# EAGLE design Buttons (EAGLE 7.7.0)
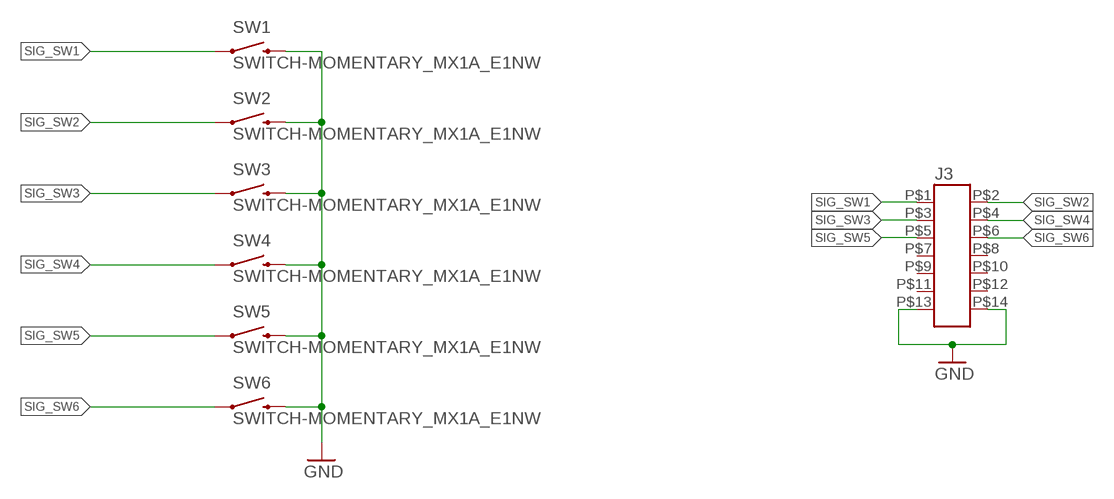
[diagram p0: schematic, sheet 1]

## Parts
J3  HEADER-2X7  [3M-3000SERIES-HEADER-RIGHTANGLE]
SW1  SWITCH-MOMENTARY_MX1A_E1NW  [CHERRY_MX1A_E1NW]
SW2  SWITCH-MOMENTARY_MX1A_E1NW  [CHERRY_MX1A_E1NW]
SW3  SWITCH-MOMENTARY_MX1A_E1NW  [CHERRY_MX1A_E1NW]
SW4  SWITCH-MOMENTARY_MX1A_E1NW  [CHERRY_MX1A_E1NW]
SW5  SWITCH-MOMENTARY_MX1A_E1NW  [CHERRY_MX1A_E1NW]
SW6  SWITCH-MOMENTARY_MX1A_E1NW  [CHERRY_MX1A_E1NW]

## Nets
GND: J3.P$13 J3.P$14 SW1.P$2 SW2.P$2 SW3.P$2 SW4.P$2 SW5.P$2 SW6.P$2
SIG_SW1: J3.P$1 SW1.P$1
SIG_SW2: J3.P$2 SW2.P$1
SIG_SW3: J3.P$3 SW3.P$1
SIG_SW4: J3.P$4 SW4.P$1
SIG_SW5: J3.P$5 SW5.P$1
SIG_SW6: J3.P$6 SW6.P$1
Unconnected: J3.P$7 J3.P$8 J3.P$9 J3.P$10 J3.P$11 J3.P$12

## Library data of the parts
J3 = Nigel:HEADER-2X7
SW1-SW6 = Nigel:SWITCH-MOMENTARY

## Board
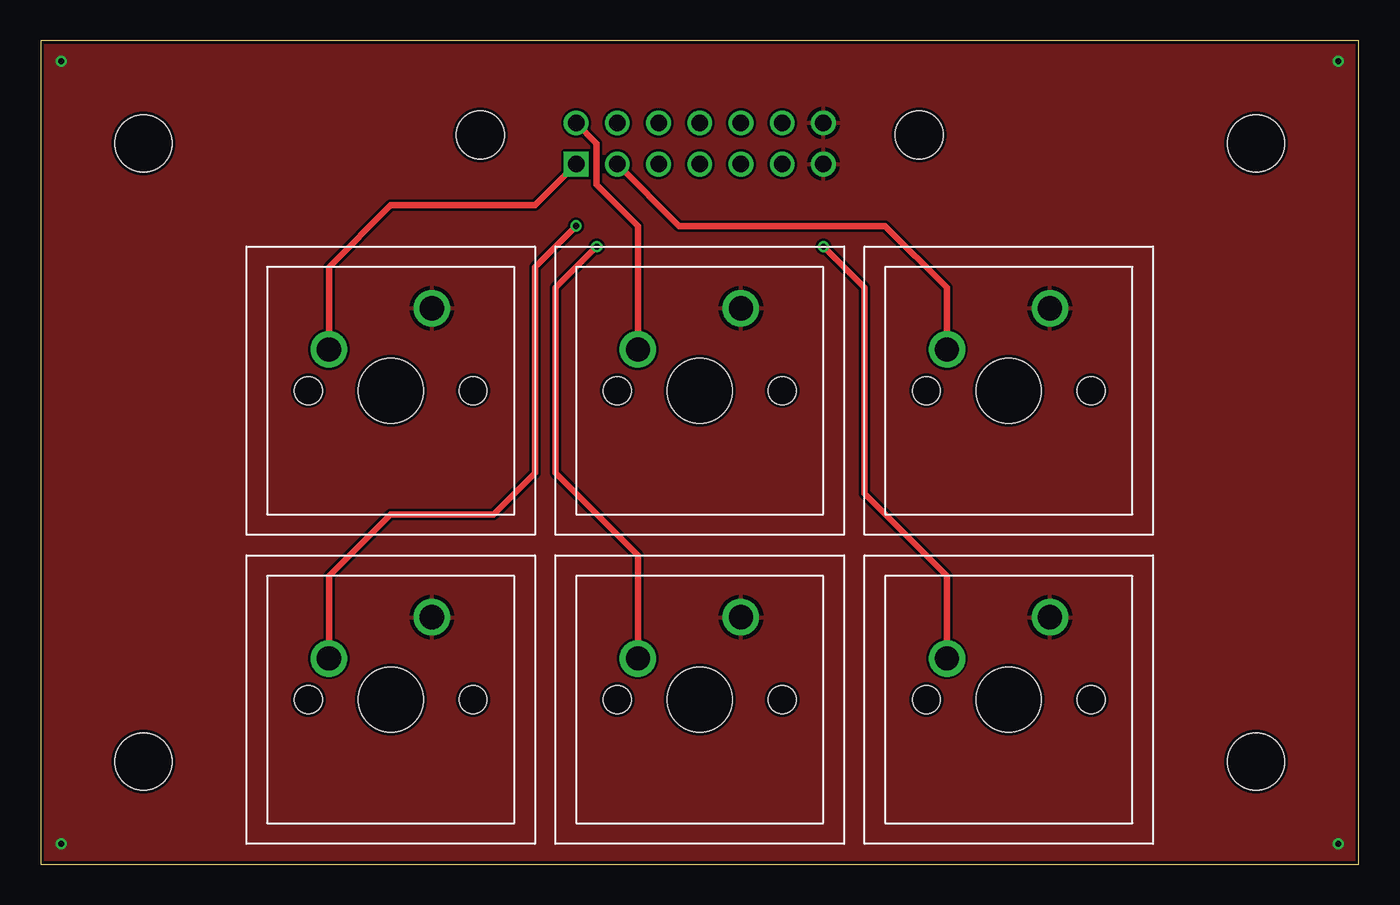
[diagram p1: board, top side]
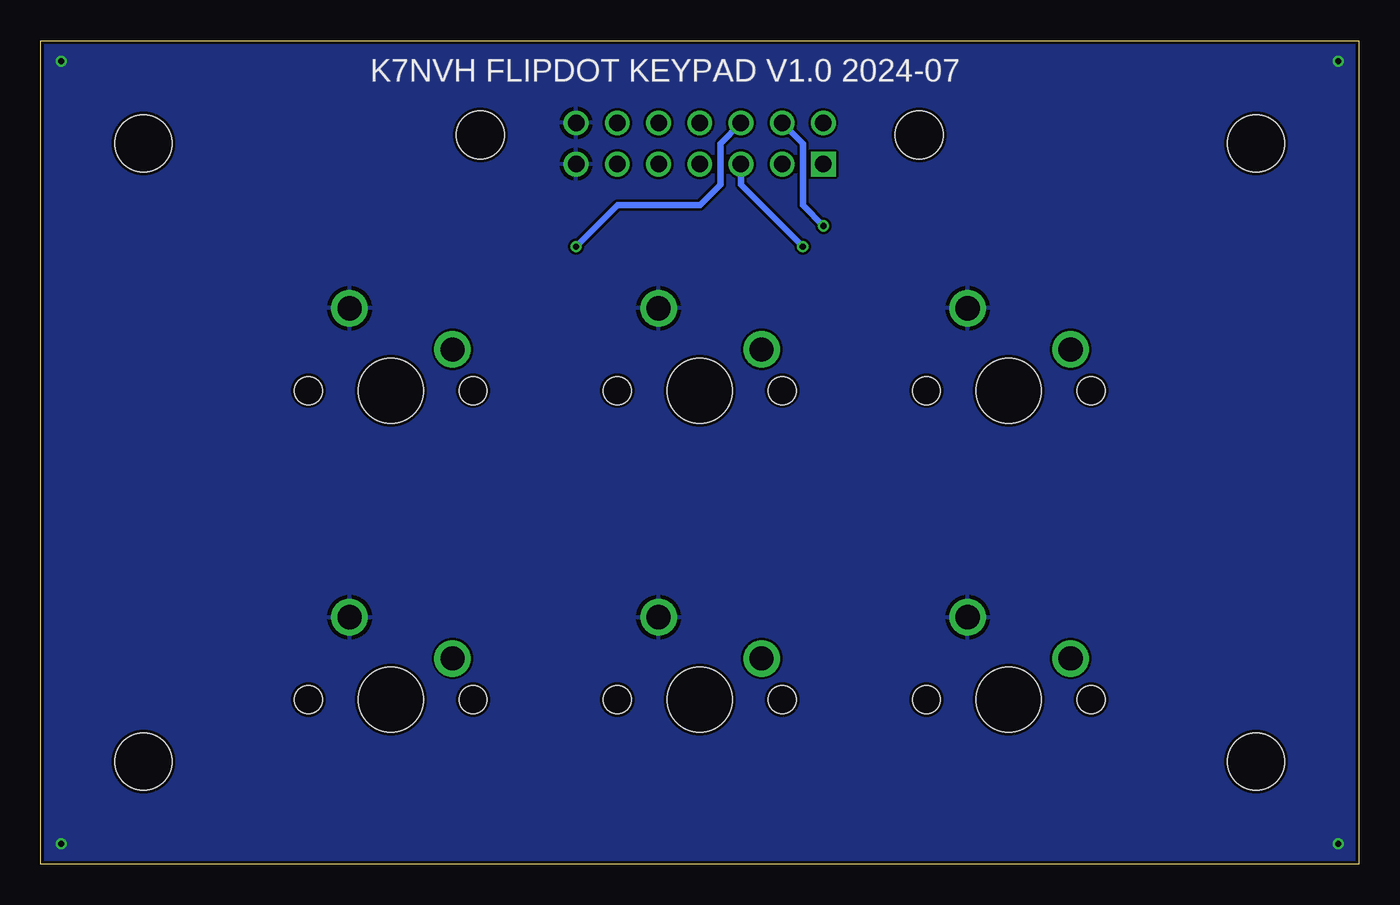
[diagram p2: board, bottom side, seen from below]

Size 81.28 x 50.8 mm. Coordinates in mm from the lower left corner, seen from the top.
Outline: 0,0 81.28,0 81.28,50.8 0,50.8 0,0
Copper layers (1*16): Top 0.0356mm / dielectric 1.5011mm / Bottom 0.0356mm
Design rules "JLCPCB *": minimum track width 5mil, minimum drill 6mil, track to track 6mil, track to pad 6mil, pad to pad 6mil, via to via 6mil, smd to smd 6mil, copper to edge 8mil, drill to drill 6mil, minimum pad ring 7mil, minimum via ring 6mil, stop-mask expansion 3mil, vias tented up to drill 12mil, thermal gap 10mil
Holes 3.51 mm at 6.35,6.35 74.93,6.35 6.35,44.45 74.93,44.45

### Footprints (pad centres in the part's own frame; a part is rotated, then mirrored left to right if it is on the bottom)
3M-3000SERIES-HEADER-RIGHTANGLE = drill 1.016 square: P$1 -7.62,-1.27 | drill 1.016: P$2 -7.62,1.27; P$3 -5.08,-1.27; P$4 -5.08,1.27; P$5 -2.54,-1.27; P$6 -2.54,1.27; P$7 0,-1.27; P$8 0,1.27; P$9 2.54,-1.27; P$10 2.54,1.27; P$11 5.08,-1.27; P$12 5.08,1.27; P$13 7.62,-1.27; P$14 7.62,1.27 | hole 2.946: -13.525,0.533; 13.525,0.533
CHERRY_MX1A_E1NW = drill 1.499: P$1 -3.81,2.54; P$2 2.54,5.08 | hole 3.988: 0,0 | hole 1.702: -5.08,0; 5.08,0

### Placement (x,y rotation side)
J3  40.64,44.45 0 top
SW1  21.59,29.21 0 top
SW2  40.64,29.21 0 top
SW3  59.69,29.21 0 top
SW4  21.59,10.16 0 top
SW5  40.64,10.16 0 top
SW6  59.69,10.16 0 top

### Tracks (layer width: path | path; a pad name or v marks a point on that pad's centre or on a via)
GND  (via drill 0.38)
  other vias: 1.27,49.53 80.01,49.53 80.01,1.27 1.27,1.27
  pour Top: 0,50.8 81.28,50.8 81.28,0 0,0
  pour Bottom: 0,50.8 81.28,50.8 81.28,0 0,0
SIG_SW1
  Top 0.406: SW1.P$1 17.78,36.83 21.59,40.64 30.48,40.64 J3.P$1
SIG_SW2
  Top 0.406: SW2.P$1 36.83,39.37 34.29,41.91 34.29,44.45 J3.P$2
SIG_SW3
  Top 0.406: SW3.P$1 55.88,35.56 52.07,39.37 39.37,39.37 J3.P$3
SIG_SW4  (via drill 0.38)
  Top 0.406: SW4.P$1 17.78,17.78 21.59,21.59 27.94,21.59 30.48,24.13 30.48,36.83 v33.02,39.37
  Bottom 0.406: v33.02,39.37 34.29,40.64 34.29,44.45 J3.P$4
SIG_SW5  (via drill 0.38)
  Top 0.406: SW5.P$1 36.83,19.05 31.75,24.13 31.75,35.56 v34.29,38.1
  Bottom 0.406: v34.29,38.1 38.1,41.91 J3.P$5
SIG_SW6  (via drill 0.38)
  Top 0.406: SW6.P$1 55.88,17.78 50.8,22.86 50.8,35.56 v48.26,38.1
  Bottom 0.406: v48.26,38.1 45.72,40.64 40.64,40.64 39.37,41.91 39.37,44.45 J3.P$6

### Text on the board
bPlace: K7NVH FLIPDOT KEYPAD V1.0 2024-07